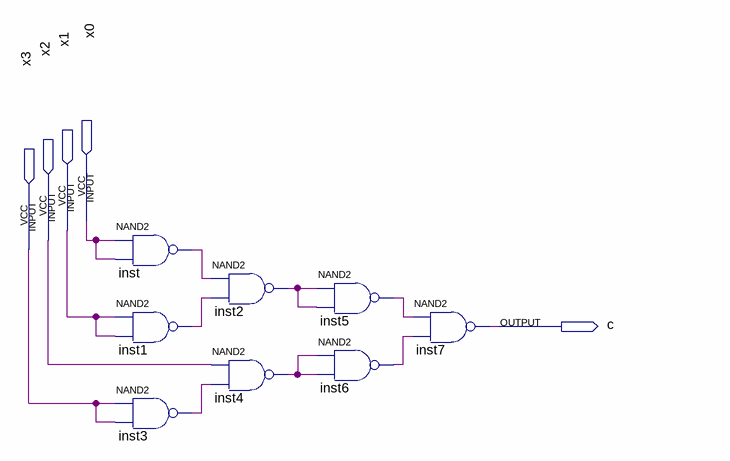
[diagram p0: schematic sheet]
// Quartus schematic DZ1_Quartus_C.bdf as structural Verilog: 8 symbols, 5 pins
module DZ1_Quartus_C (
  input  x0,
  input  x1,
  input  x2,
  input  x3,
  output c
);

  wire inst1_out, inst2_out, inst3_out, inst4_out, inst5_out, inst6_out, inst_out;

  nand inst (inst_out, x0, x0);
  nand inst1 (inst1_out, x1, x1);
  nand inst3 (inst3_out, x3, x3);
  nand inst2 (inst2_out, inst_out, inst1_out);
  nand inst4 (inst4_out, x2, inst3_out);
  nand inst5 (inst5_out, inst2_out, inst2_out);
  nand inst6 (inst6_out, inst4_out, inst4_out);
  nand inst7 (c, inst5_out, inst6_out);
endmodule
